# EAGLE schematic 4bit Register Board (EAGLE 9.2.1)
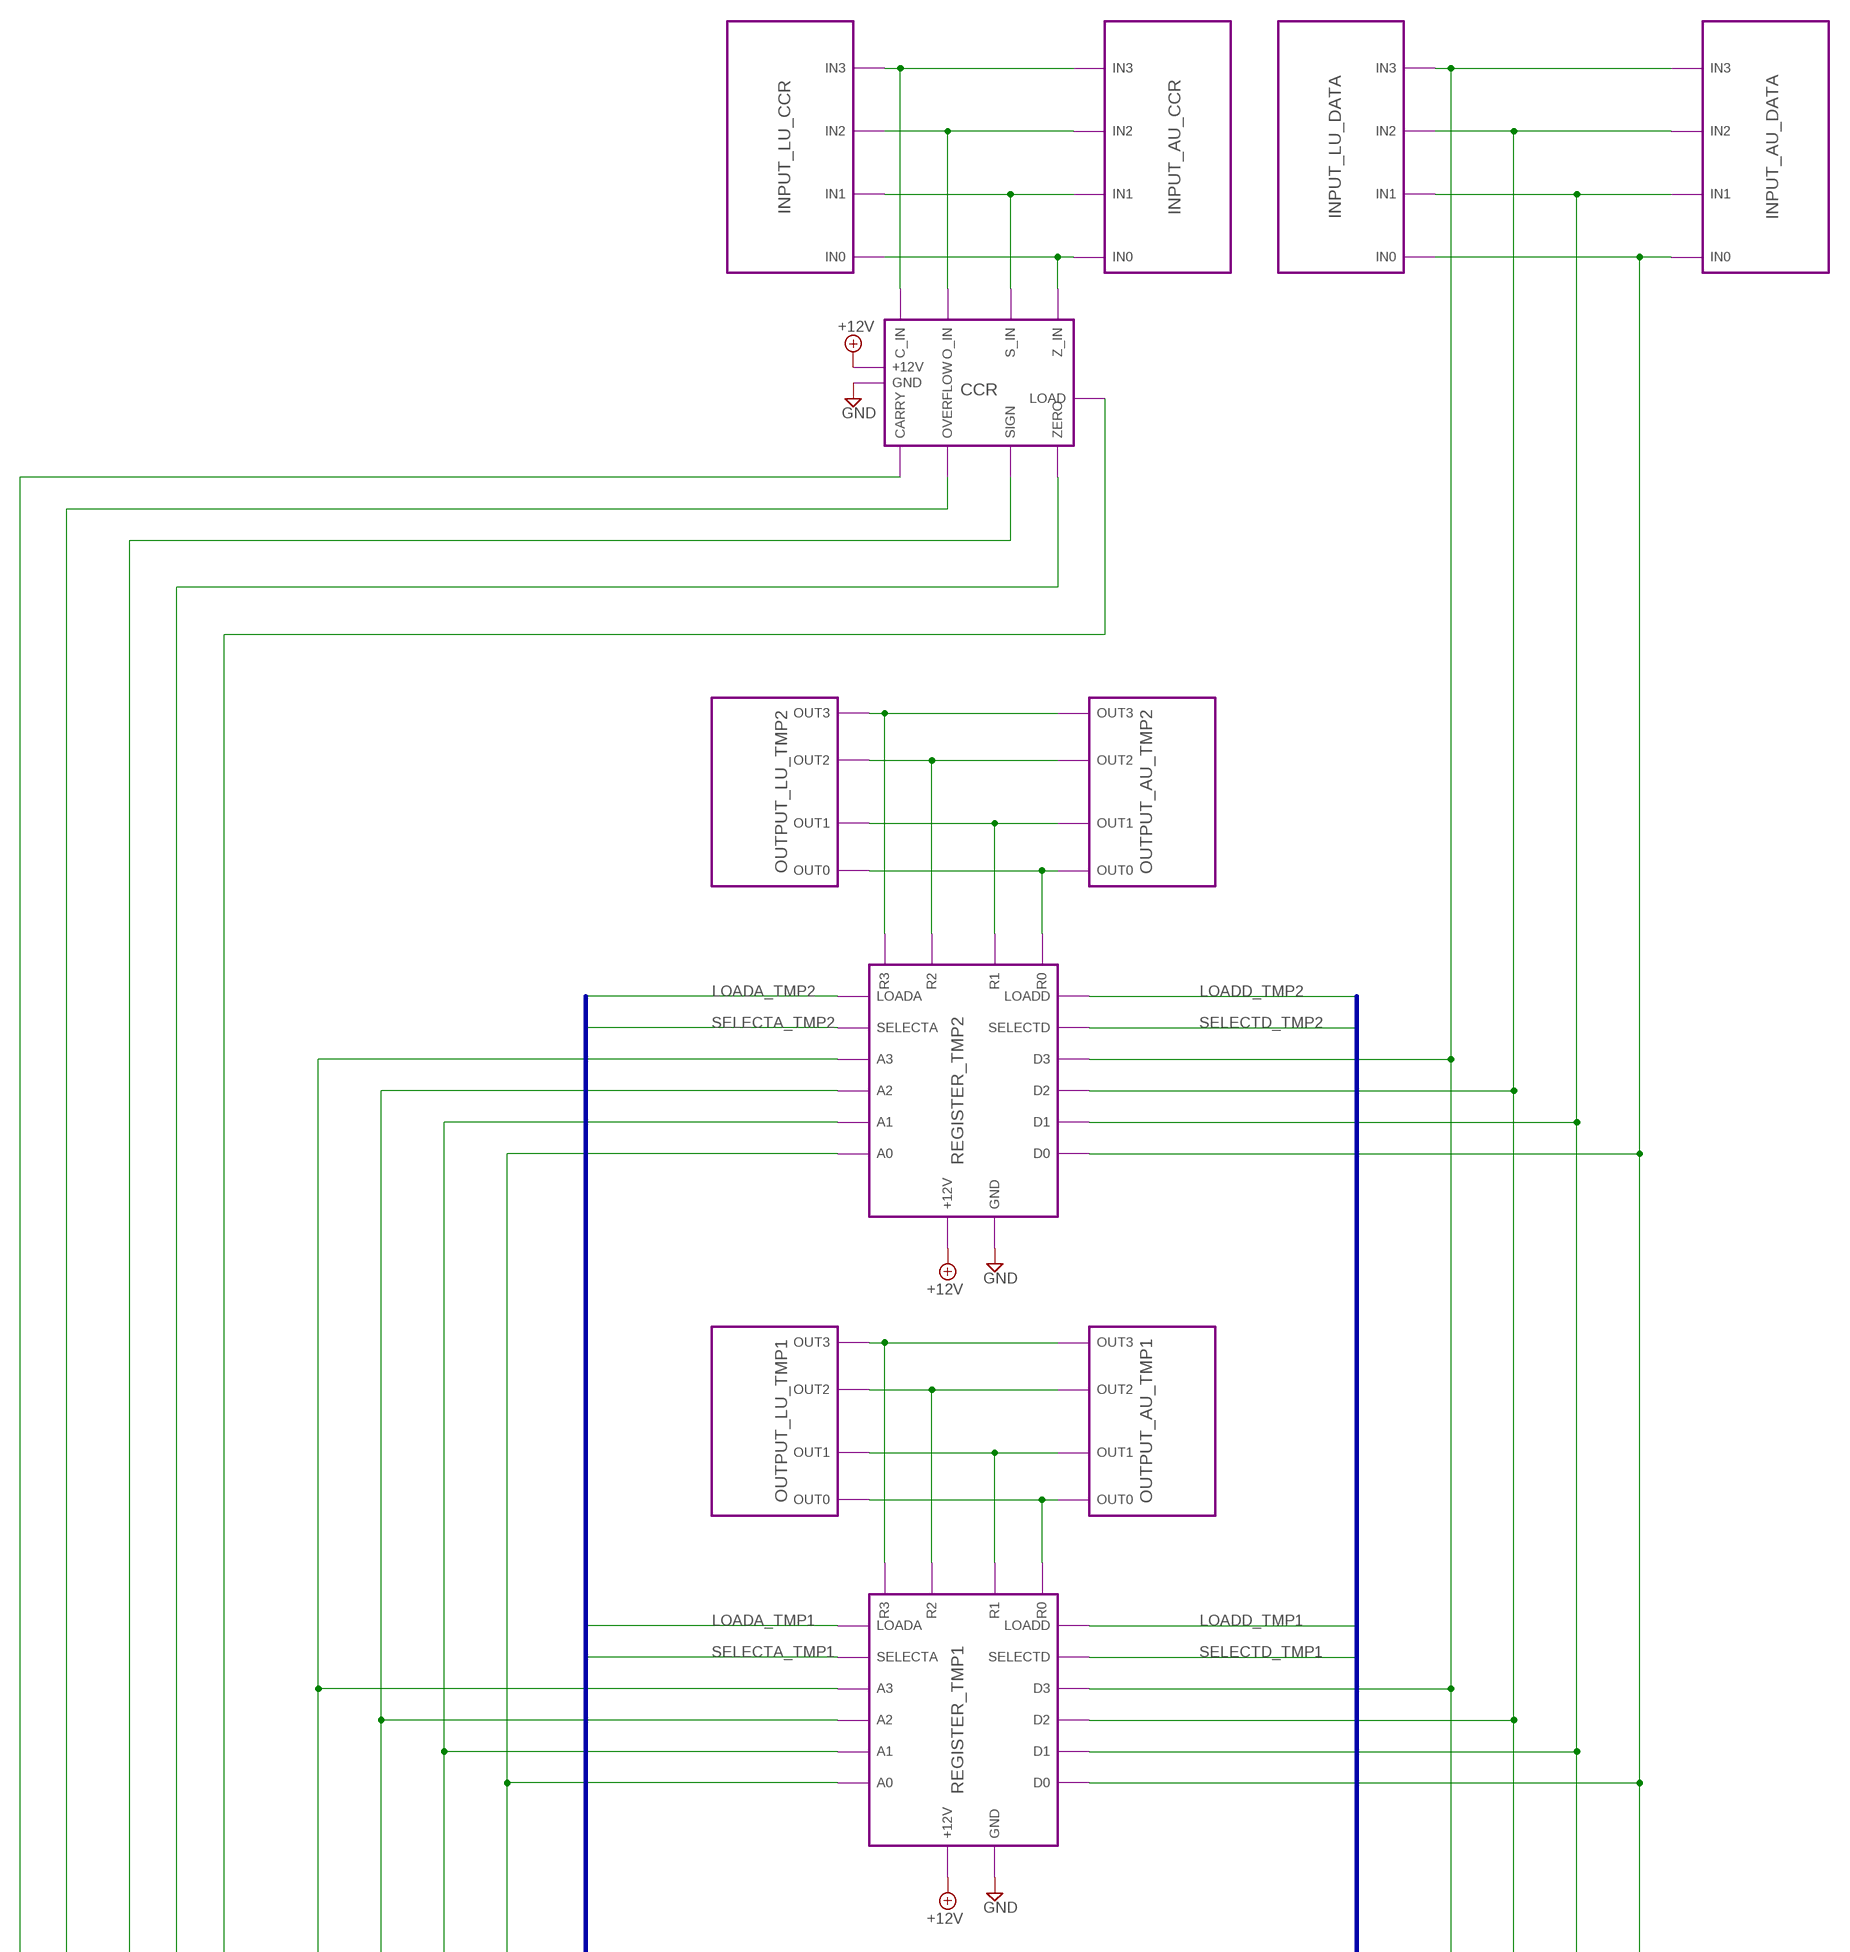
[diagram p0: schematic, sheet 1, part 1 of 2]
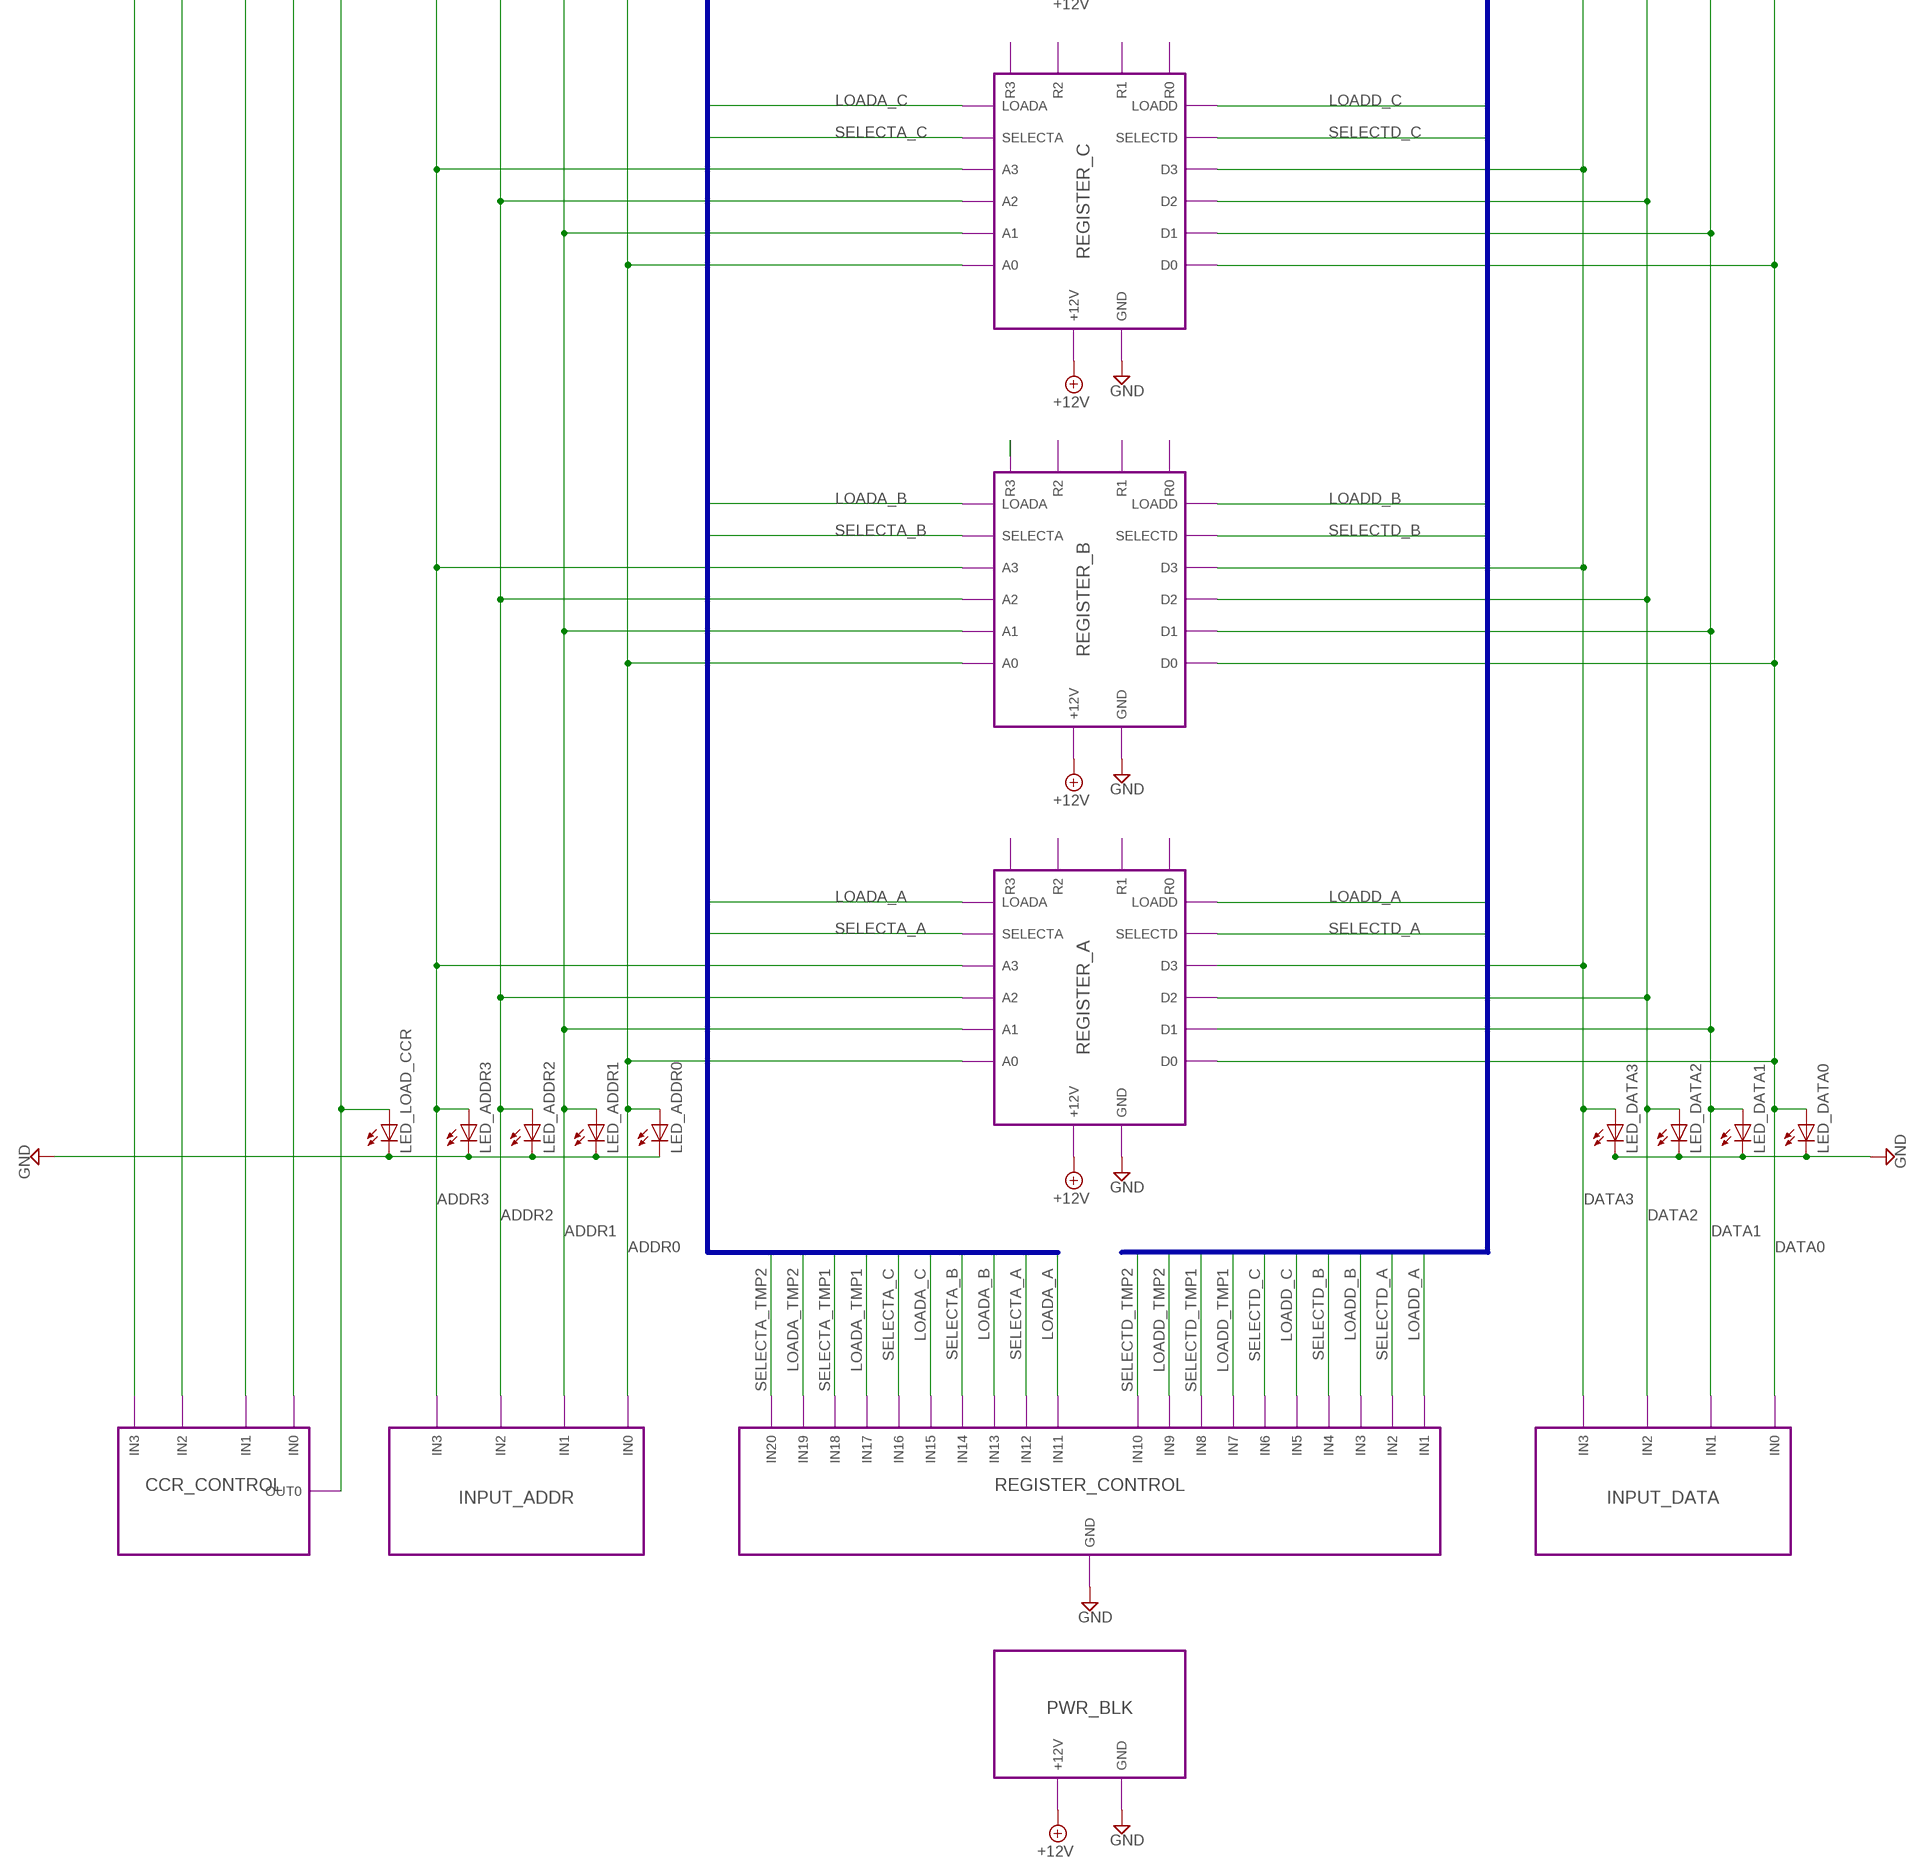
[diagram p1: schematic, sheet 1, part 2 of 2]

## Parts
LED_ADDR0  LED3MM  [LED3MM]
LED_ADDR1  LED3MM  [LED3MM]
LED_ADDR2  LED3MM  [LED3MM]
LED_ADDR3  LED3MM  [LED3MM]
LED_DATA0  LED3MM  [LED3MM]
LED_DATA1  LED3MM  [LED3MM]
LED_DATA2  LED3MM  [LED3MM]
LED_DATA3  LED3MM  [LED3MM]
LED_LOAD_CCR  LED3MM  [LED3MM]

## Module instances
PWR_BLK = PWR_BLK
INPUT_DATA = INPUT4
INPUT_ADDR = INPUT4
REGISTER_C = REGISTER4
REGISTER_B = REGISTER4
REGISTER_A = REGISTER4
CCR = CC_REGISTER
INPUT_AU_CCR = INPUT4
INPUT_LU_CCR = INPUT4
CCR_CONTROL = CONNECT5
REGISTER_CONTROL = INPUT20
INPUT_AU_DATA = INPUT4
INPUT_LU_DATA = INPUT4
REGISTER_TMP1 = REGISTER4
OUTPUT_AU_TMP1 = OUTPUT4
OUTPUT_LU_TMP1 = OUTPUT4
REGISTER_TMP2 = REGISTER4
OUTPUT_AU_TMP2 = OUTPUT4
OUTPUT_LU_TMP2 = OUTPUT4

## Nets
+12V: port PWR_BLK.+12V REGISTER_A.+12V REGISTER_B.+12V REGISTER_C.+12V CCR.+12V REGISTER_TMP1.+12V REGISTER_TMP2.+12V
ADDR0: LED_ADDR0.A ; port INPUT_ADDR.IN0 REGISTER_A.A0 REGISTER_B.A0 REGISTER_C.A0 REGISTER_TMP1.A0 REGISTER_TMP2.A0
ADDR1: LED_ADDR1.A ; port INPUT_ADDR.IN1 REGISTER_A.A1 REGISTER_B.A1 REGISTER_C.A1 REGISTER_TMP1.A1 REGISTER_TMP2.A1
ADDR2: LED_ADDR2.A ; port INPUT_ADDR.IN2 REGISTER_A.A2 REGISTER_B.A2 REGISTER_C.A2 REGISTER_TMP1.A2 REGISTER_TMP2.A2
ADDR3: LED_ADDR3.A ; port INPUT_ADDR.IN3 REGISTER_A.A3 REGISTER_B.A3 REGISTER_C.A3 REGISTER_TMP1.A3 REGISTER_TMP2.A3
DATA0: LED_DATA0.A ; port INPUT_DATA.IN0 REGISTER_A.D0 REGISTER_B.D0 REGISTER_C.D0 INPUT_AU_DATA.IN0 INPUT_LU_DATA.IN0 REGISTER_TMP1.D0 REGISTER_TMP2.D0
DATA1: LED_DATA1.A ; port INPUT_DATA.IN1 REGISTER_A.D1 REGISTER_B.D1 REGISTER_C.D1 INPUT_LU_DATA.IN1 INPUT_AU_DATA.IN1 REGISTER_TMP1.D1 REGISTER_TMP2.D1
DATA2: LED_DATA2.A ; port INPUT_DATA.IN2 REGISTER_A.D2 REGISTER_B.D2 REGISTER_C.D2 INPUT_AU_DATA.IN2 INPUT_LU_DATA.IN2 REGISTER_TMP1.D2 REGISTER_TMP2.D2
DATA3: LED_DATA3.A ; port INPUT_DATA.IN3 REGISTER_A.D3 REGISTER_B.D3 REGISTER_C.D3 INPUT_LU_DATA.IN3 INPUT_AU_DATA.IN3 REGISTER_TMP1.D3 REGISTER_TMP2.D3
GND: LED_ADDR0.K(C) LED_ADDR1.K(C) LED_ADDR2.K(C) LED_ADDR3.K(C) LED_DATA0.K(C) LED_DATA1.K(C) LED_DATA2.K(C) LED_DATA3.K(C) LED_LOAD_CCR.K(C) ; port PWR_BLK.GND REGISTER_A.GND REGISTER_B.GND REGISTER_C.GND CCR.GND REGISTER_CONTROL.GND REGISTER_TMP1.GND REGISTER_TMP2.GND
LOAD_CCR: LED_LOAD_CCR.A ; port CCR.LOAD CCR_CONTROL.OUT0
LOADA_A: port REGISTER_A.LOADA REGISTER_CONTROL.IN11
LOADA_B: port REGISTER_B.LOADA REGISTER_CONTROL.IN13
LOADA_C: port REGISTER_C.LOADA REGISTER_CONTROL.IN15
LOADA_TMP1: port REGISTER_TMP1.LOADA REGISTER_CONTROL.IN17
LOADA_TMP2: port REGISTER_TMP2.LOADA REGISTER_CONTROL.IN19
LOADD_A: port REGISTER_A.LOADD REGISTER_CONTROL.IN1
LOADD_B: port REGISTER_B.LOADD REGISTER_CONTROL.IN3
LOADD_C: port REGISTER_C.LOADD REGISTER_CONTROL.IN5
LOADD_TMP1: port REGISTER_TMP1.LOADD REGISTER_CONTROL.IN7
LOADD_TMP2: port REGISTER_TMP2.LOADD REGISTER_CONTROL.IN9
N$1: port OUTPUT_LU_TMP2.OUT3 OUTPUT_AU_TMP2.OUT3 REGISTER_TMP2.R3
N$2: port OUTPUT_LU_TMP2.OUT2 OUTPUT_AU_TMP2.OUT2 REGISTER_TMP2.R2
N$3: port OUTPUT_LU_TMP2.OUT1 OUTPUT_AU_TMP2.OUT1 REGISTER_TMP2.R1
N$4: port OUTPUT_LU_TMP2.OUT0 OUTPUT_AU_TMP2.OUT0 REGISTER_TMP2.R0
N$5: port REGISTER_B.R3
N$9: port INPUT_AU_CCR.IN0 INPUT_LU_CCR.IN0 CCR.Z_IN
N$10: port INPUT_LU_CCR.IN1 CCR.S_IN INPUT_AU_CCR.IN1
N$11: port INPUT_AU_CCR.IN2 INPUT_LU_CCR.IN2 CCR.O_IN
N$12: port INPUT_LU_CCR.IN3 INPUT_AU_CCR.IN3 CCR.C_IN
N$13: port CCR.CARRY CCR_CONTROL.IN3
N$14: port CCR_CONTROL.IN2 CCR.OVERFLOW
N$15: port CCR_CONTROL.IN1 CCR.SIGN
N$16: port CCR.ZERO CCR_CONTROL.IN0
N$18: port OUTPUT_LU_TMP1.OUT3 OUTPUT_AU_TMP1.OUT3 REGISTER_TMP1.R3
N$19: port OUTPUT_LU_TMP1.OUT2 OUTPUT_AU_TMP1.OUT2 REGISTER_TMP1.R2
N$20: port OUTPUT_LU_TMP1.OUT1 OUTPUT_AU_TMP1.OUT1 REGISTER_TMP1.R1
N$21: port OUTPUT_LU_TMP1.OUT0 OUTPUT_AU_TMP1.OUT0 REGISTER_TMP1.R0
SELECTA_A: port REGISTER_A.SELECTA REGISTER_CONTROL.IN12
SELECTA_B: port REGISTER_B.SELECTA REGISTER_CONTROL.IN14
SELECTA_C: port REGISTER_C.SELECTA REGISTER_CONTROL.IN16
SELECTA_TMP1: port REGISTER_TMP1.SELECTA REGISTER_CONTROL.IN18
SELECTA_TMP2: port REGISTER_TMP2.SELECTA REGISTER_CONTROL.IN20
SELECTD_A: port REGISTER_A.SELECTD REGISTER_CONTROL.IN2
SELECTD_B: port REGISTER_B.SELECTD REGISTER_CONTROL.IN4
SELECTD_C: port REGISTER_C.SELECTD REGISTER_CONTROL.IN6
SELECTD_TMP1: port REGISTER_TMP1.SELECTD REGISTER_CONTROL.IN8
SELECTD_TMP2: port REGISTER_TMP2.SELECTD REGISTER_CONTROL.IN10

## Buses
LOADD_A,SELECTD_A,LOADD_B,SELECTD_B,LOADD_C,SELECTD_C,LOADD_TMP1,SELECTD_TMP1,LOADD_TMP2,SELECTD_TMP2
LOADA_A,SELECTA_A,LOADA_B,SELECTA_B,LOADA_C,SELECTA_C,LOADA_TMP1,SELECTA_TMP1,LOADA_TMP2,SELECTA_TMP2

## Library data of the parts
LED_ADDR0 LED_ADDR1-LED_ADDR3 LED_DATA0 LED_DATA1-LED_DATA3 LED_LOAD_CCR = relay_computer_custom:LED: VCC 12V LED w/ built-in resistor

## Module PWR_BLK
Ports: +12V(pwr) GND(pwr)
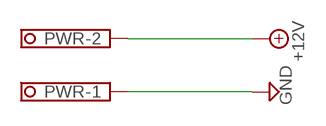
[diagram p2: schematic, module PWR_BLK, sheet 1]

### Parts
PWR  PWR_BLK  [1751248]

### Nets
+12V: PWR.2
GND: PWR.1

### Library data of the parts
PWR = relay_computer_custom:PWR_BLK: MKDS 1/ 2-3,5 Printklemme Nennstrom: 10 A Bemessungsspannung: 160 V Raster: 3,5 mm Polzahl: 2 Montageart: Löten Anschlussart: Schraubanschluss Anschlussrichtung vom Leiter zur Platine: 0° Source: http://eshop.phoenixcontact.com .. 1751248.pdf; OC_FARNELL: unknown; OC_NEWARK: unknown

## Module INPUT4
Ports: IN3(out) IN2(out) IN1(out) IN0(out)
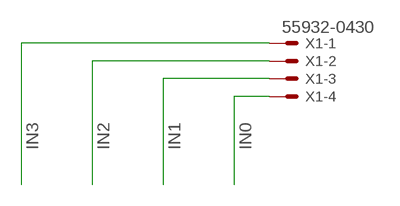
[diagram p3: schematic, module INPUT4, sheet 1]

### Parts
X1  55932-0430  [55932-0430]

### Nets
IN0: X1.4
IN1: X1.3
IN2: X1.2
IN3: X1.1

### Library data of the parts
X1 = relay_computer_custom:55932-0430: 4 pin- 2.00mm Pitch MicroClasp™ Wire-to-Board Header, Single Row, Vertical, without PCB Locator Source: http://www.molex.com/pdm_docs/sd/559320430_sd.pdf

## Module ENABLE4
Ports: GND(pwr) ENABLE(in) OUT3(out) OUT2(out) OUT1(out) OUT0(out) IN3(in) IN2(in) IN1(in) IN0(in)
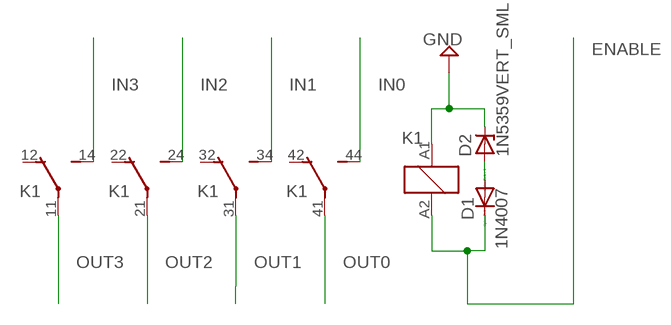
[diagram p4: schematic, module ENABLE4, sheet 1]

### Parts
D1  1N4007  [RAD2,5]
D2  1N5359VERT_SML  [RAD2.5_D2]
K1  PY14-02  [PY14-02]

### Nets
D$1: D1.A D2.A
ENABLE: D1.C K1.A2
GND: D2.C K1.A1
IN0: K1.44(5:S)
IN1: K1.34(4:S)
IN2: K1.24(3:S)
IN3: K1.14(2:S)
OUT0: K1.41(5:P)
OUT1: K1.31(4:P)
OUT2: K1.21(3:P)
OUT3: K1.11(2:P)
Unconnected: K1.12(2:O) K1.22(3:O) K1.32(4:O) K1.42(5:O)

### Library data of the parts
D1 = relay_computer_custom:1N4007: DIODE general purpose rectifier, 1 A
D2 = relay_computer_custom:1N5359: Z DIODE 24 V, 5W
K1 = relay_computer_custom:PY14-02: Miniature Relay OMRON 12VDC 4PDT 3A Relay Relay: MY4DC12 https://octopart.com/my4dc12-omron-13160135 Socket: PY14-02 https://octopart.com/py14-02-omron-113738

## Module REGISTER4
Ports: +12V(pwr) GND(pwr) LOADA(in) SELECTA(in) A3(io) A2(io) A1(io) A0(io) D0(io) D1(io) D2(io) D3(io) SELECTD(in) LOADD(in) R3(io) R2(io) R1(io) R0(io)
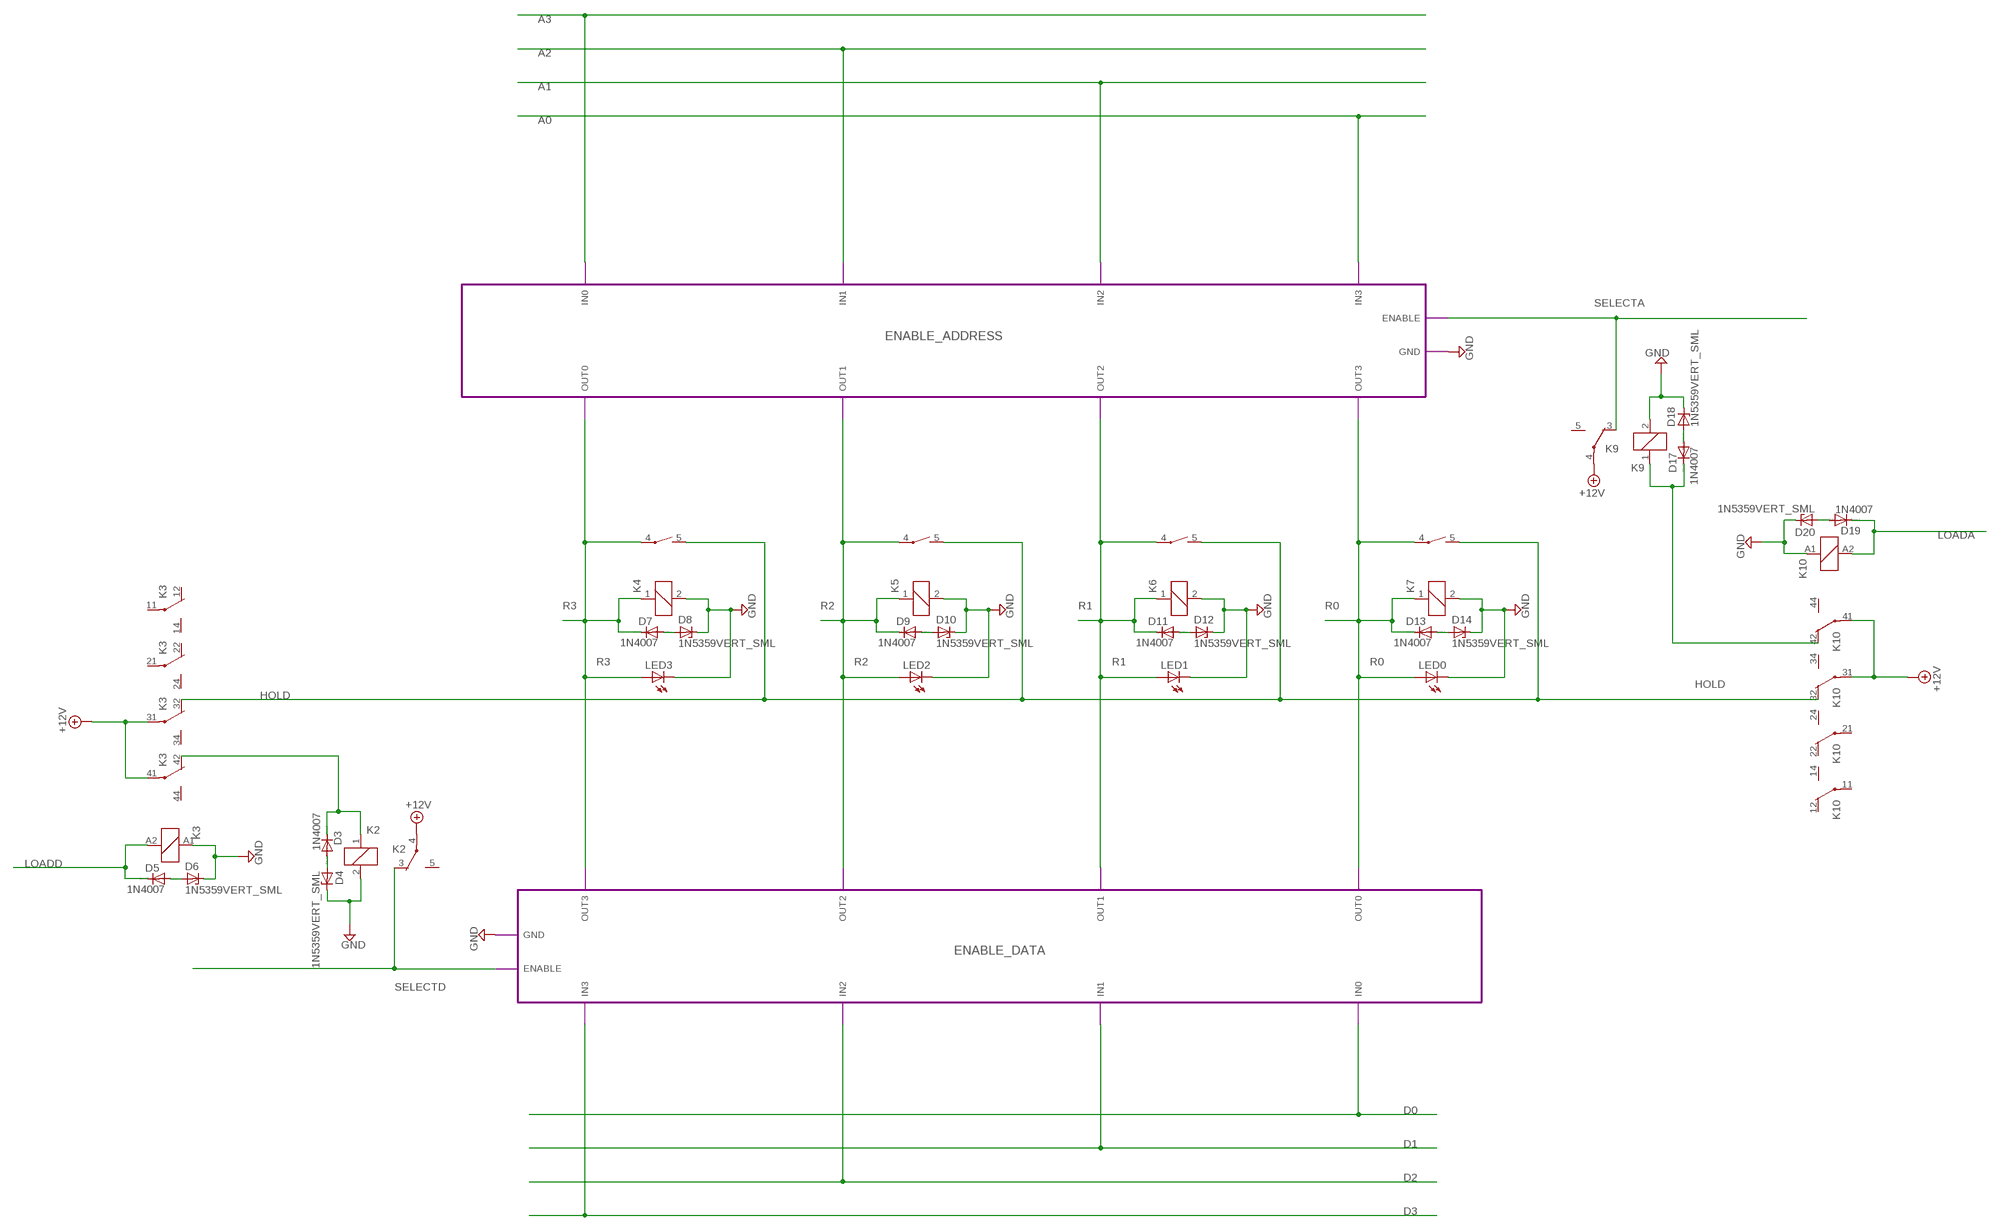
[diagram p5: schematic, module REGISTER4, sheet 1]

### Parts
D3  1N4007  [RAD2,5]
D4  1N5359VERT_SML  [RAD2.5_D2]
D5  1N4007  [RAD2,5]
D6  1N5359VERT_SML  [RAD2.5_D2]
D7  1N4007  [RAD2,5]
D8  1N5359VERT_SML  [RAD2.5_D2]
D9  1N4007  [RAD2,5]
D10  1N5359VERT_SML  [RAD2.5_D2]
D11  1N4007  [RAD2,5]
D12  1N5359VERT_SML  [RAD2.5_D2]
D13  1N4007  [RAD2,5]
D14  1N5359VERT_SML  [RAD2.5_D2]
D17  1N4007  [RAD2,5]
D18  1N5359VERT_SML  [RAD2.5_D2]
D19  1N4007  [RAD2,5]
D20  1N5359VERT_SML  [RAD2.5_D2]
K2  HF41F-12-Z  [HF41F-12-Z]
K3  PY14-02  [PY14-02]
K4  HF41F-12-H  [HF41F-12-H]
K5  HF41F-12-H  [HF41F-12-H]
K6  HF41F-12-H  [HF41F-12-H]
K7  HF41F-12-H  [HF41F-12-H]
K9  HF41F-12-Z  [HF41F-12-Z]
K10  PY14-02  [PY14-02]
LED0  LED3MM  [LED3MM]
LED1  LED3MM  [LED3MM]
LED2  LED3MM  [LED3MM]
LED3  LED3MM  [LED3MM]

### Module instances
ENABLE_DATA = ENABLE4
ENABLE_ADDRESS = ENABLE4

### Nets
+12V: K2.4(2:P) K3.31(4:P) K3.41(5:P) K9.4(2:P) K10.31(4:P) K10.41(5:P)
A0: port ENABLE_ADDRESS.IN3
A1: port ENABLE_ADDRESS.IN2
A2: port ENABLE_ADDRESS.IN1
A3: port ENABLE_ADDRESS.IN0
D0: port ENABLE_DATA.IN0
D1: port ENABLE_DATA.IN1
D2: port ENABLE_DATA.IN2
D3: port ENABLE_DATA.IN3
D$2: D3.A D4.A
D$3: D5.A D6.A
D$4: D7.A D8.A
D$5: D9.A D10.A
D$6: D11.A D12.A
D$7: D13.A D14.A
D$9: D17.A D18.A
D$10: D19.A D20.A
GND: D4.C D6.C D8.C D10.C D12.C D14.C D18.C D20.C K2.2 K3.A1 K4.2 K5.2 K6.2 K7.2 K9.2 K10.A1 LED0.K(C) LED1.K(C) LED2.K(C) LED3.K(C) ; port ENABLE_DATA.GND ENABLE_ADDRESS.GND
HOLD: K3.32(4:O) K4.5(S) K5.5(S) K6.5(S) K7.5(S) K10.32(4:O)
IN: D3.C K2.1 K3.42(5:O)
IN1: D17.C K9.1 K10.42(5:O)
LOADA: D19.C K10.A2
LOADD: D5.C K3.A2
R0: D13.C K7.1 K7.4(P) LED0.A ; port ENABLE_DATA.OUT0 ENABLE_ADDRESS.OUT3
R1: D11.C K6.1 K6.4(P) LED1.A ; port ENABLE_DATA.OUT1 ENABLE_ADDRESS.OUT2
R2: D9.C K5.1 K5.4(P) LED2.A ; port ENABLE_DATA.OUT2 ENABLE_ADDRESS.OUT1
R3: D7.C K4.1 K4.4(P) LED3.A ; port ENABLE_DATA.OUT3 ENABLE_ADDRESS.OUT0
SELECTA: K9.3(2:O) ; port ENABLE_ADDRESS.ENABLE
SELECTD: K2.3(2:O) ; port ENABLE_DATA.ENABLE
Unconnected: K2.5(2:S) K3.11(2:P) K3.12(2:O) K3.14(2:S) K3.21(3:P) K3.22(3:O) K3.24(3:S) K3.34(4:S) K3.44(5:S) K9.5(2:S) K10.11(2:P) K10.12(2:O) K10.14(2:S) K10.21(3:P) K10.22(3:O) K10.24(3:S) K10.34(4:S) K10.44(5:S)

### Library data of the parts
D3 D5 D7 D9 D11 D13 D17 D19 = relay_computer_custom:1N4007: DIODE general purpose rectifier, 1 A
D4 D6 D8 D10 D12 D14 D18 D20 = relay_computer_custom:1N5359: Z DIODE 24 V, 5W
K2 K9 = relay_computer_custom:HF41F-12-Z: SPDT RELAY Relay SPDT 5mm x 28mm HONGFA
K3 K10 = relay_computer_custom:PY14-02: Miniature Relay OMRON 12VDC 4PDT 3A Relay Relay: MY4DC12 https://octopart.com/my4dc12-omron-13160135 Socket: PY14-02 https://octopart.com/py14-02-omron-113738
K4-K7 = relay_computer_custom:HF41F-12-H: SPST RELAY Relay SPST 5mm x 28mm HONGFA
LED0 LED1-LED3 = relay_computer_custom:LED: VCC 12V LED w/ built-in resistor

## Module OUTPUT4
Ports: OUT3(in) OUT2(in) OUT1(in) OUT0(in)
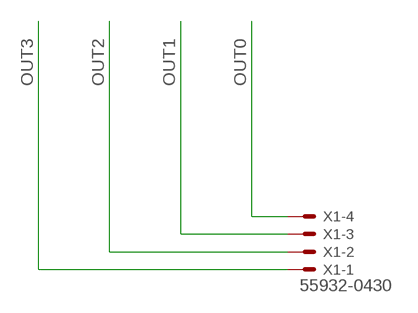
[diagram p6: schematic, module OUTPUT4, sheet 1]

### Parts
X1  55932-0430  [55932-0430]

### Nets
OUT0: X1.4
OUT1: X1.3
OUT2: X1.2
OUT3: X1.1

### Library data of the parts
X1 = relay_computer_custom:55932-0430: 4 pin- 2.00mm Pitch MicroClasp™ Wire-to-Board Header, Single Row, Vertical, without PCB Locator Source: http://www.molex.com/pdm_docs/sd/559320430_sd.pdf

## Module CC_REGISTER
Ports: Z_IN(in) S_IN(in) C_IN(in) O_IN(in) +12V(pwr) GND(pwr) CARRY(out) OVERFLOW(out) SIGN(out) ZERO(out) LOAD(in)
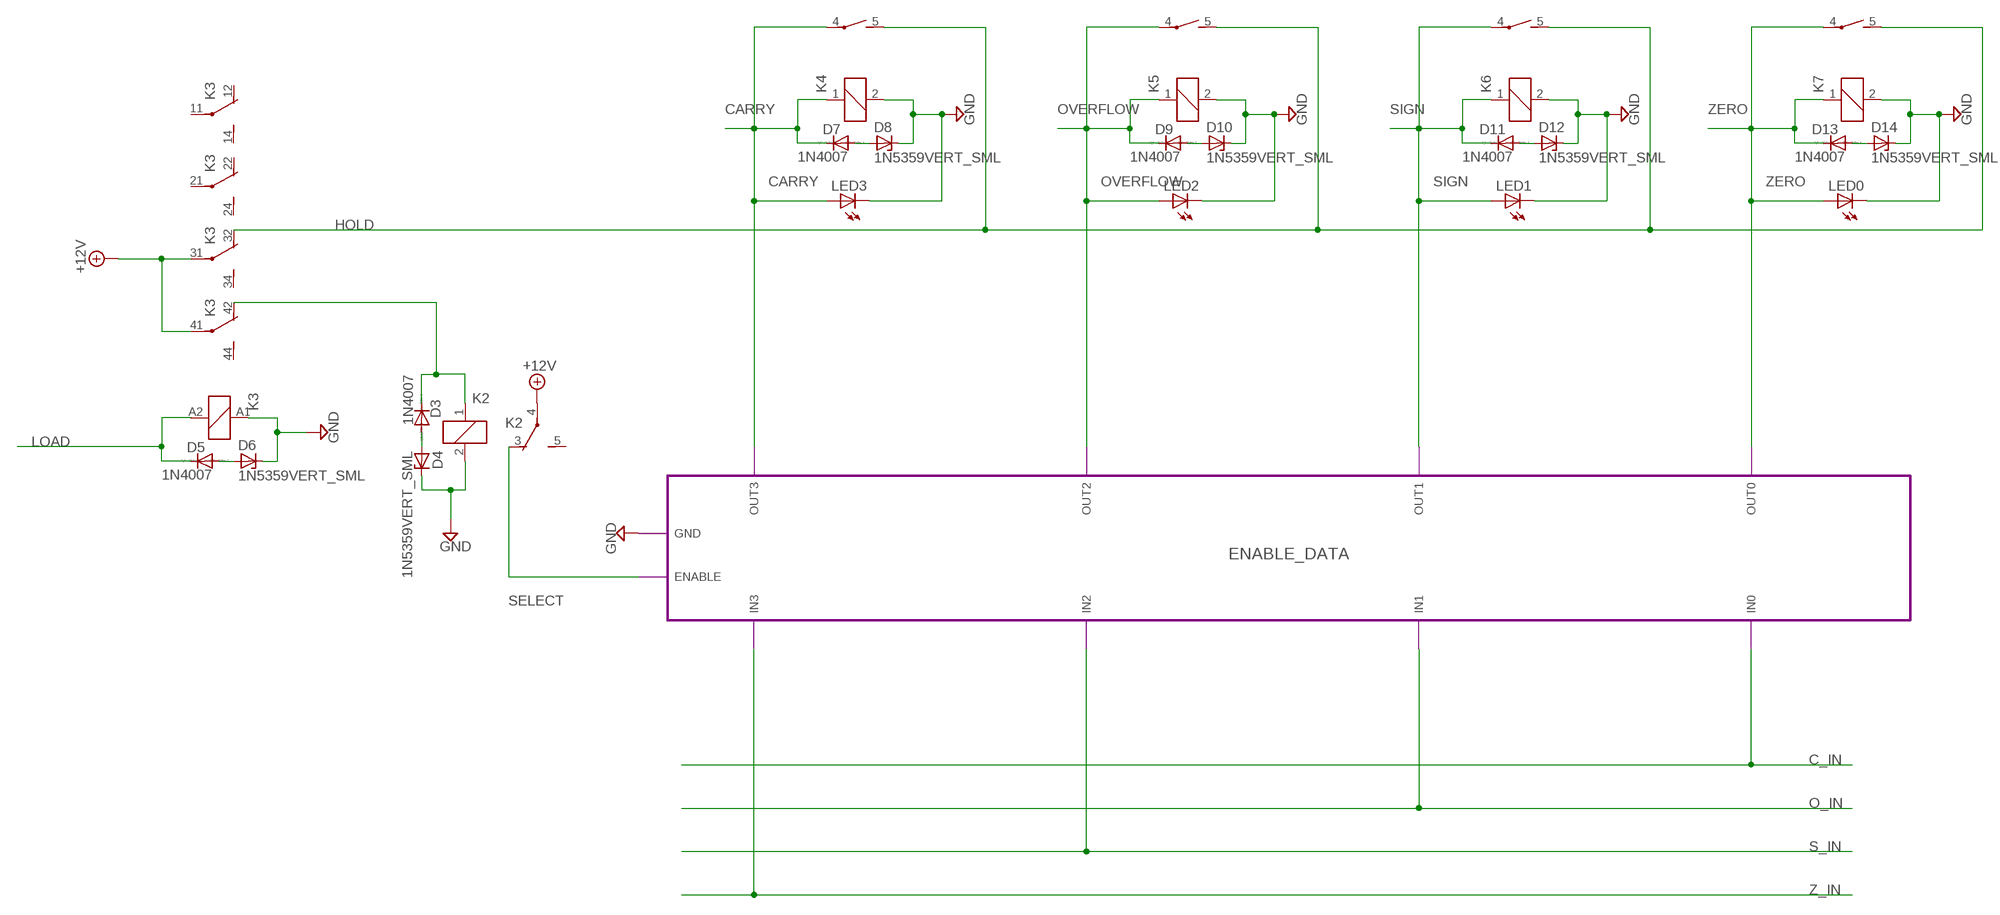
[diagram p7: schematic, module CC_REGISTER, sheet 1]

### Parts
D3  1N4007  [RAD2,5]
D4  1N5359VERT_SML  [RAD2.5_D2]
D5  1N4007  [RAD2,5]
D6  1N5359VERT_SML  [RAD2.5_D2]
D7  1N4007  [RAD2,5]
D8  1N5359VERT_SML  [RAD2.5_D2]
D9  1N4007  [RAD2,5]
D10  1N5359VERT_SML  [RAD2.5_D2]
D11  1N4007  [RAD2,5]
D12  1N5359VERT_SML  [RAD2.5_D2]
D13  1N4007  [RAD2,5]
D14  1N5359VERT_SML  [RAD2.5_D2]
K2  HF41F-12-Z  [HF41F-12-Z]
K3  PY14-02  [PY14-02]
K4  HF41F-12-H  [HF41F-12-H]
K5  HF41F-12-H  [HF41F-12-H]
K6  HF41F-12-H  [HF41F-12-H]
K7  HF41F-12-H  [HF41F-12-H]
LED0  LED3MM  [LED3MM]
LED1  LED3MM  [LED3MM]
LED2  LED3MM  [LED3MM]
LED3  LED3MM  [LED3MM]

### Module instances
ENABLE_DATA = ENABLE4

### Nets
+12V: K2.4(2:P) K3.31(4:P) K3.41(5:P)
C_IN: port ENABLE_DATA.IN0
CARRY: D7.C K4.1 K4.4(P) LED3.A ; port ENABLE_DATA.OUT3
D$2: D3.A D4.A
D$3: D5.A D6.A
D$4: D7.A D8.A
D$5: D9.A D10.A
D$6: D11.A D12.A
D$7: D13.A D14.A
GND: D4.C D6.C D8.C D10.C D12.C D14.C K2.2 K3.A1 K4.2 K5.2 K6.2 K7.2 LED0.K(C) LED1.K(C) LED2.K(C) LED3.K(C) ; port ENABLE_DATA.GND
HOLD: K3.32(4:O) K4.5(S) K5.5(S) K6.5(S) K7.5(S)
IN: D3.C K2.1 K3.42(5:O)
LOAD: D5.C K3.A2
O_IN: port ENABLE_DATA.IN1
OVERFLOW: D9.C K5.1 K5.4(P) LED2.A ; port ENABLE_DATA.OUT2
S_IN: port ENABLE_DATA.IN2
SELECT: K2.3(2:O) ; port ENABLE_DATA.ENABLE
SIGN: D11.C K6.1 K6.4(P) LED1.A ; port ENABLE_DATA.OUT1
Z_IN: port ENABLE_DATA.IN3
ZERO: D13.C K7.1 K7.4(P) LED0.A ; port ENABLE_DATA.OUT0
Unconnected: K2.5(2:S) K3.11(2:P) K3.12(2:O) K3.14(2:S) K3.21(3:P) K3.22(3:O) K3.24(3:S) K3.34(4:S) K3.44(5:S)

### Library data of the parts
D3 D5 D7 D9 D11 D13 = relay_computer_custom:1N4007: DIODE general purpose rectifier, 1 A
D4 D6 D8 D10 D12 D14 = relay_computer_custom:1N5359: Z DIODE 24 V, 5W
K2 = relay_computer_custom:HF41F-12-Z: SPDT RELAY Relay SPDT 5mm x 28mm HONGFA
K3 = relay_computer_custom:PY14-02: Miniature Relay OMRON 12VDC 4PDT 3A Relay Relay: MY4DC12 https://octopart.com/my4dc12-omron-13160135 Socket: PY14-02 https://octopart.com/py14-02-omron-113738
K4-K7 = relay_computer_custom:HF41F-12-H: SPST RELAY Relay SPST 5mm x 28mm HONGFA
LED0 LED1-LED3 = relay_computer_custom:LED: VCC 12V LED w/ built-in resistor

## Module CONNECT5
Ports: IN3(in) IN2(in) IN1(in) IN0(in) OUT0(out)
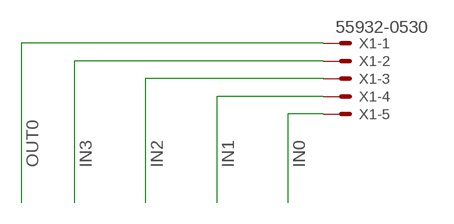
[diagram p8: schematic, module CONNECT5, sheet 1]

### Parts
X1  55932-0530  [55932-0530]

### Nets
IN0: X1.5
IN1: X1.4
IN2: X1.3
IN3: X1.2
OUT0: X1.1

### Library data of the parts
X1 = relay_computer_custom:55932-0530: 5 pin- 2.00mm Pitch MicroClasp™ Wire-to-Board Header, Single Row, Vertical, without PCB Locator Source: http://www.molex.com/pdm_docs/sd/559320530_sd.pdf

## Module INPUT20
Ports: IN1(out) IN3(out) IN5(out) IN7(out) IN9(out) IN11(out) IN2(out) IN4(out) IN6(out) IN8(out) IN10(out) IN12(out) GND(pwr) IN13(out) IN14(out) IN15(out) IN16(out) IN17(out) IN18(out) IN19(out) IN20(out)
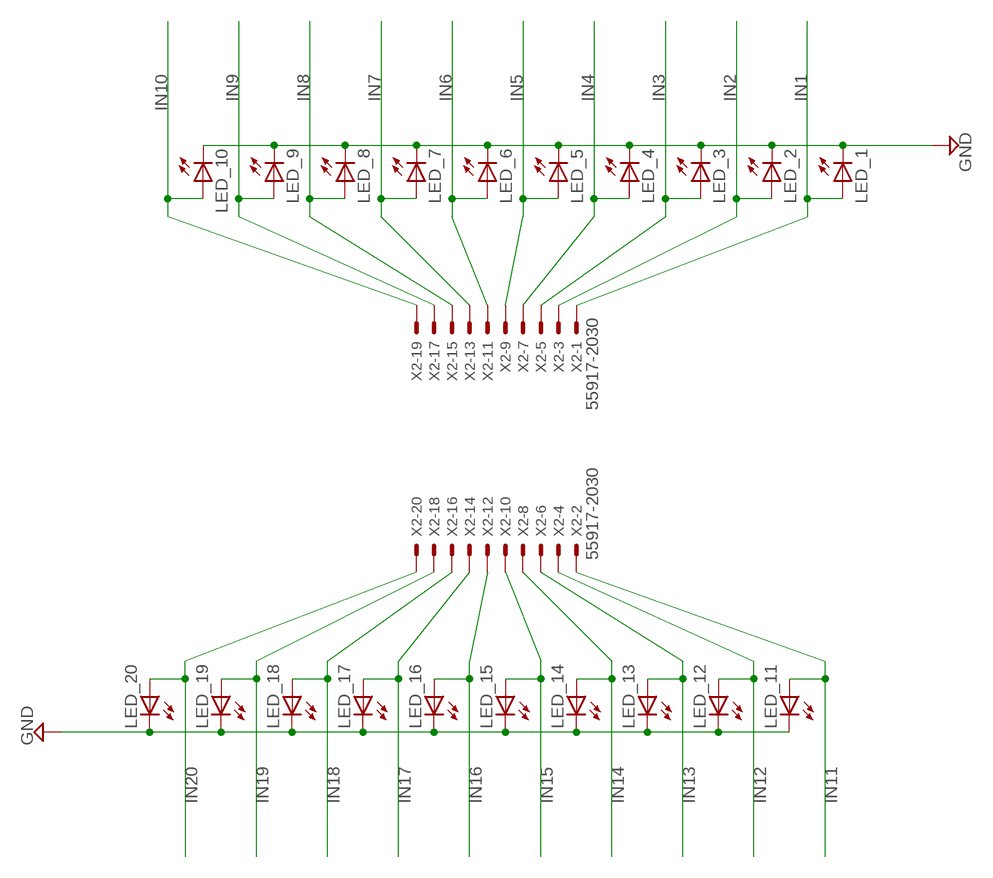
[diagram p9: schematic, module INPUT20, sheet 1]

### Parts
LED_1  LED3MM  [LED3MM]
LED_2  LED3MM  [LED3MM]
LED_3  LED3MM  [LED3MM]
LED_4  LED3MM  [LED3MM]
LED_5  LED3MM  [LED3MM]
LED_6  LED3MM  [LED3MM]
LED_7  LED3MM  [LED3MM]
LED_8  LED3MM  [LED3MM]
LED_9  LED3MM  [LED3MM]
LED_10  LED3MM  [LED3MM]
LED_11  LED3MM  [LED3MM]
LED_12  LED3MM  [LED3MM]
LED_13  LED3MM  [LED3MM]
LED_14  LED3MM  [LED3MM]
LED_15  LED3MM  [LED3MM]
LED_16  LED3MM  [LED3MM]
LED_17  LED3MM  [LED3MM]
LED_18  LED3MM  [LED3MM]
LED_19  LED3MM  [LED3MM]
LED_20  LED3MM  [LED3MM]
X2  55917-2030  [55917-2030]

### Nets
GND: LED_1.K(C) LED_2.K(C) LED_3.K(C) LED_4.K(C) LED_5.K(C) LED_6.K(C) LED_7.K(C) LED_8.K(C) LED_9.K(C) LED_10.K(C) LED_11.K(C) LED_12.K(C) LED_13.K(C) LED_14.K(C) LED_15.K(C) LED_16.K(C) LED_17.K(C) LED_18.K(C) LED_19.K(C) LED_20.K(C)
IN1: LED_1.A X2.1
IN2: LED_2.A X2.3
IN3: LED_3.A X2.5
IN4: LED_4.A X2.7
IN5: LED_5.A X2.9
IN6: LED_6.A X2.11
IN7: LED_7.A X2.13
IN8: LED_8.A X2.15
IN9: LED_9.A X2.17
IN10: LED_10.A X2.19
IN11: LED_11.A
IN12: LED_12.A
IN13: LED_13.A
IN14: LED_14.A
IN15: LED_15.A
IN16: LED_16.A
IN17: LED_17.A
IN18: LED_18.A
IN19: LED_19.A
IN20: LED_20.A
Unconnected: X2.2 X2.4 X2.6 X2.8 X2.10 X2.12 X2.14 X2.16 X2.18 X2.20

### Library data of the parts
LED_1-LED_20 = relay_computer_custom:LED: VCC 12V LED w/ built-in resistor
X2 = relay_computer_custom:55917-2030: 20 Pin - 2mm Dual Row Single Wafer, Vertical T/H HDR Source: http://www.molex.com/pdm_docs/sd/5591720 30_sd.pdf